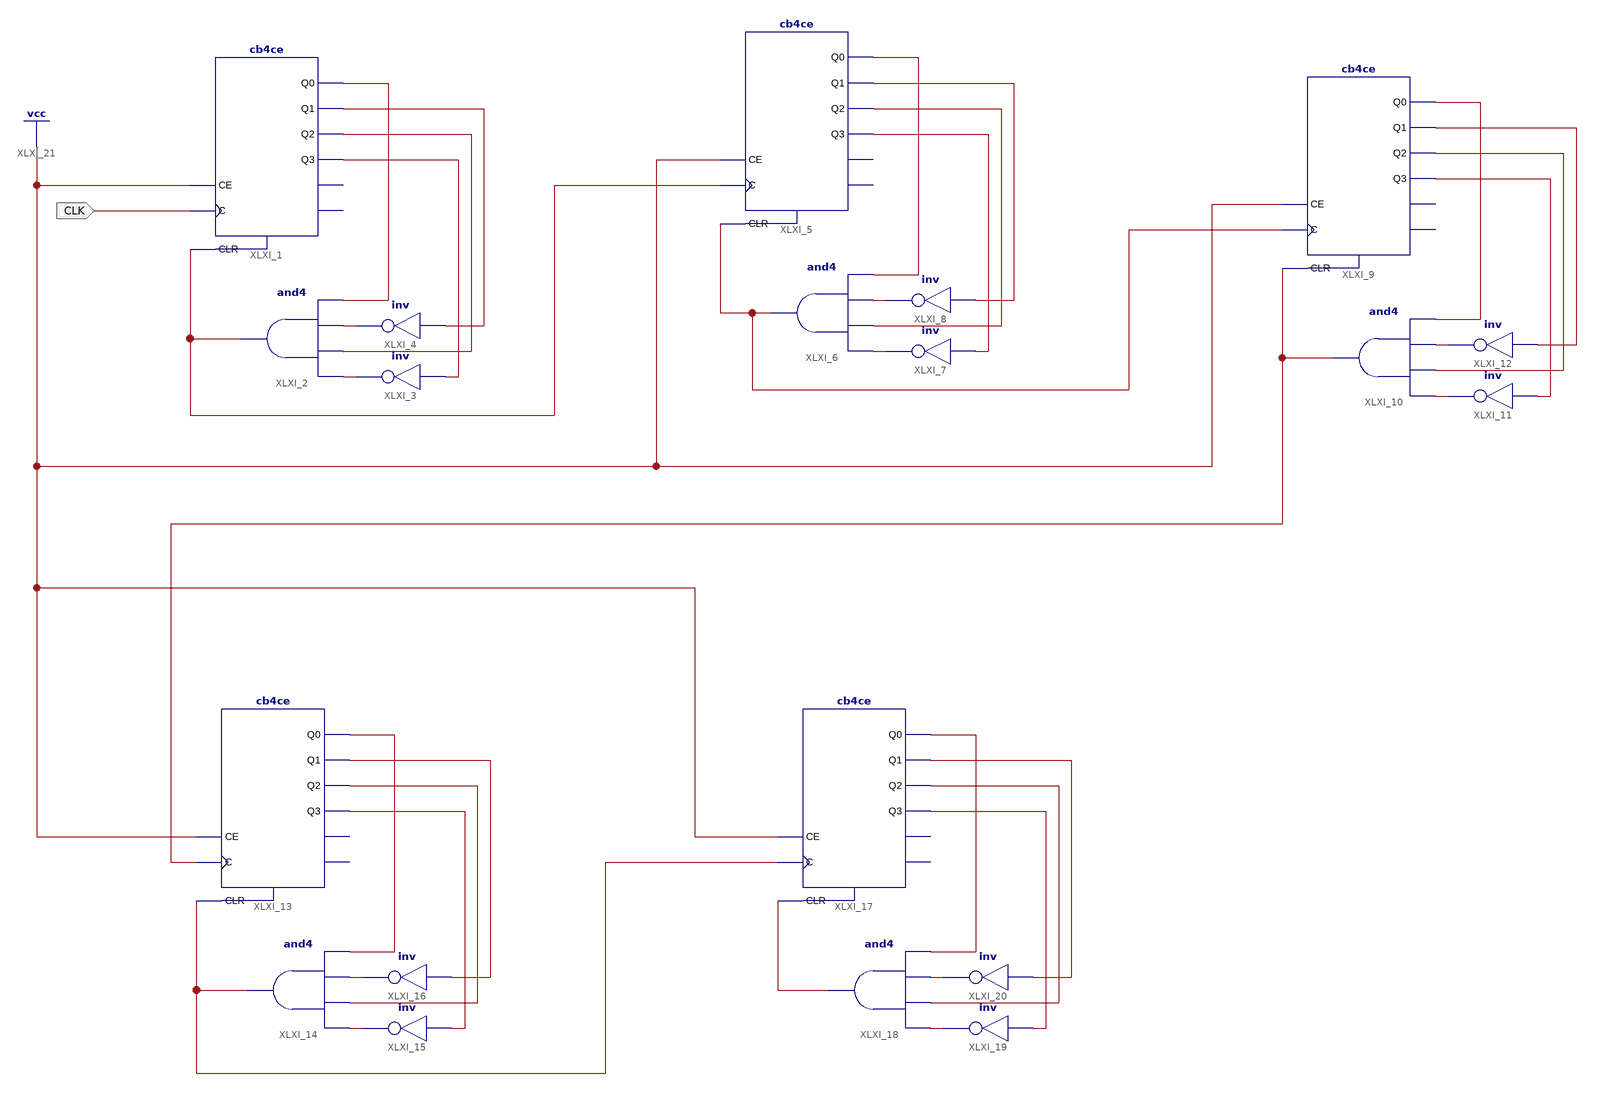
[diagram p0: schematic sheet 1]
// Xilinx ISE schematic div100k.sch (spartan6) as structural Verilog: 20 symbols, 1 ports
module div100k (
  input  CLK
);

  wire XLXN_1, XLXN_2, XLXN_3, XLXN_4, XLXN_5, XLXN_6, XLXN_8, XLXN_9, XLXN_10, XLXN_11, XLXN_12, XLXN_13,
       XLXN_14, XLXN_15, XLXN_16, XLXN_17, XLXN_18, XLXN_19, XLXN_20, XLXN_21, XLXN_22, XLXN_23, XLXN_24,
       XLXN_25, XLXN_26, XLXN_27, XLXN_28, XLXN_29, XLXN_30, XLXN_31, XLXN_32, XLXN_33, XLXN_34, XLXN_35,
       XLXN_36;

  cb4ce XLXI_1 (.C(CLK), .CE(1'b1), .CLR(XLXN_8), .Q0(XLXN_3), .Q1(XLXN_4), .Q2(XLXN_5), .Q3(XLXN_6));  // open: CEO, TC
  and XLXI_2 (XLXN_8, XLXN_3, XLXN_2, XLXN_5, XLXN_1);
  not XLXI_3 (XLXN_1, XLXN_6);
  not XLXI_4 (XLXN_2, XLXN_4);
  cb4ce XLXI_5 (
    .C(XLXN_8), .CE(1'b1), .CLR(XLXN_15), .Q0(XLXN_11), .Q1(XLXN_12), .Q2(XLXN_14), .Q3(XLXN_13));  // open: CEO, TC
  and XLXI_6 (XLXN_15, XLXN_11, XLXN_10, XLXN_14, XLXN_9);
  not XLXI_7 (XLXN_9, XLXN_13);
  not XLXI_8 (XLXN_10, XLXN_12);
  cb4ce XLXI_9 (
    .C(XLXN_15), .CE(1'b1), .CLR(XLXN_22), .Q0(XLXN_18), .Q1(XLXN_19), .Q2(XLXN_21), .Q3(XLXN_20));  // open: CEO, TC
  and XLXI_10 (XLXN_22, XLXN_18, XLXN_17, XLXN_21, XLXN_16);
  not XLXI_11 (XLXN_16, XLXN_20);
  not XLXI_12 (XLXN_17, XLXN_19);
  cb4ce XLXI_13 (
    .C(XLXN_22), .CE(1'b1), .CLR(XLXN_29), .Q0(XLXN_25), .Q1(XLXN_26), .Q2(XLXN_28), .Q3(XLXN_27));  // open: CEO, TC
  and XLXI_14 (XLXN_29, XLXN_25, XLXN_24, XLXN_28, XLXN_23);
  not XLXI_15 (XLXN_23, XLXN_27);
  not XLXI_16 (XLXN_24, XLXN_26);
  cb4ce XLXI_17 (
    .C(XLXN_29), .CE(1'b1), .CLR(XLXN_36), .Q0(XLXN_32), .Q1(XLXN_33), .Q2(XLXN_35), .Q3(XLXN_34));  // open: CEO, TC
  and XLXI_18 (XLXN_36, XLXN_32, XLXN_31, XLXN_35, XLXN_30);
  not XLXI_19 (XLXN_30, XLXN_34);
  not XLXI_20 (XLXN_31, XLXN_33);
endmodule
